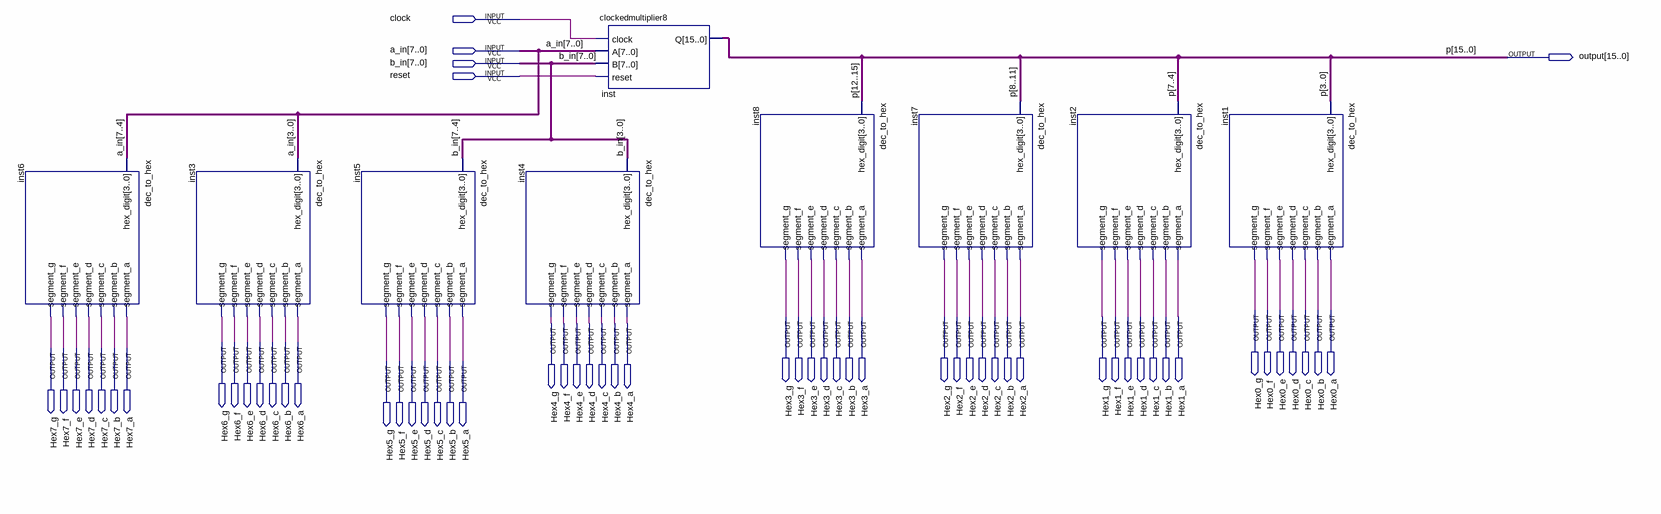
[diagram p0: schematic sheet]
// Quartus schematic reg_multiplier8.bdf as structural Verilog: 9 symbols, 61 pins
module reg_multiplier8 (
  input  clock,
  input  [7:0] a_in,
  input  [7:0] b_in,
  input  reset,
  output [15:0] \output ,
  output Hex0_g,
  output Hex0_f,
  output Hex0_e,
  output Hex0_d,
  output Hex0_c,
  output Hex0_b,
  output Hex0_a,
  output Hex3_g,
  output Hex3_f,
  output Hex3_e,
  output Hex3_d,
  output Hex3_c,
  output Hex3_b,
  output Hex3_a,
  output Hex2_g,
  output Hex2_f,
  output Hex2_e,
  output Hex2_d,
  output Hex2_c,
  output Hex2_b,
  output Hex2_a,
  output Hex1_g,
  output Hex1_f,
  output Hex1_e,
  output Hex1_d,
  output Hex1_c,
  output Hex1_b,
  output Hex1_a,
  output Hex4_g,
  output Hex4_f,
  output Hex4_e,
  output Hex4_d,
  output Hex4_c,
  output Hex4_b,
  output Hex4_a,
  output Hex6_g,
  output Hex6_f,
  output Hex6_e,
  output Hex6_d,
  output Hex6_c,
  output Hex6_b,
  output Hex6_a,
  output Hex7_g,
  output Hex7_f,
  output Hex7_e,
  output Hex7_d,
  output Hex7_c,
  output Hex7_b,
  output Hex7_a,
  output Hex5_g,
  output Hex5_f,
  output Hex5_e,
  output Hex5_d,
  output Hex5_c,
  output Hex5_b,
  output Hex5_a
);

  dec_to_hex inst6 (
    .hex_digit(a_in[7:4]), .segment_a(Hex7_a), .segment_b(Hex7_b), .segment_c(Hex7_c), .segment_d(Hex7_d),
    .segment_e(Hex7_e), .segment_f(Hex7_f), .segment_g(Hex7_g));
  dec_to_hex inst3 (
    .hex_digit(a_in[3:0]), .segment_a(Hex6_a), .segment_b(Hex6_b), .segment_c(Hex6_c), .segment_d(Hex6_d),
    .segment_e(Hex6_e), .segment_f(Hex6_f), .segment_g(Hex6_g));
  dec_to_hex inst5 (
    .hex_digit(b_in[7:4]), .segment_a(Hex5_a), .segment_b(Hex5_b), .segment_c(Hex5_c), .segment_d(Hex5_d),
    .segment_e(Hex5_e), .segment_f(Hex5_f), .segment_g(Hex5_g));
  dec_to_hex inst4 (
    .hex_digit(b_in[3:0]), .segment_a(Hex4_a), .segment_b(Hex4_b), .segment_c(Hex4_c), .segment_d(Hex4_d),
    .segment_e(Hex4_e), .segment_f(Hex4_f), .segment_g(Hex4_g));
  clockedmultiplier8 inst (.clock(clock), .A(a_in), .B(b_in), .reset(reset), .Q(\output ));
  dec_to_hex inst8 (
    .hex_digit({\output [12], \output [13], \output [14], \output [15]}), .segment_a(Hex3_a),
    .segment_b(Hex3_b), .segment_c(Hex3_c), .segment_d(Hex3_d), .segment_e(Hex3_e), .segment_f(Hex3_f),
    .segment_g(Hex3_g));
  dec_to_hex inst7 (
    .hex_digit({\output [8], \output [9], \output [10], \output [11]}), .segment_a(Hex2_a),
    .segment_b(Hex2_b), .segment_c(Hex2_c), .segment_d(Hex2_d), .segment_e(Hex2_e), .segment_f(Hex2_f),
    .segment_g(Hex2_g));
  dec_to_hex inst2 (
    .hex_digit(\output [7:4]), .segment_a(Hex1_a), .segment_b(Hex1_b), .segment_c(Hex1_c),
    .segment_d(Hex1_d), .segment_e(Hex1_e), .segment_f(Hex1_f), .segment_g(Hex1_g));
  dec_to_hex inst1 (
    .hex_digit(\output [3:0]), .segment_a(Hex0_a), .segment_b(Hex0_b), .segment_c(Hex0_c),
    .segment_d(Hex0_d), .segment_e(Hex0_e), .segment_f(Hex0_f), .segment_g(Hex0_g));

  // Other names for the same wires on the sheet: p[15:0] = \output 
endmodule
